# Altium schematic sheet Charge_Conn.SchDoc: Charger Input
size A4; DrawnBy: Samyar Sadat Akhavi; Revision: 1.0; SheetNumber: 4; SheetTotal: 14
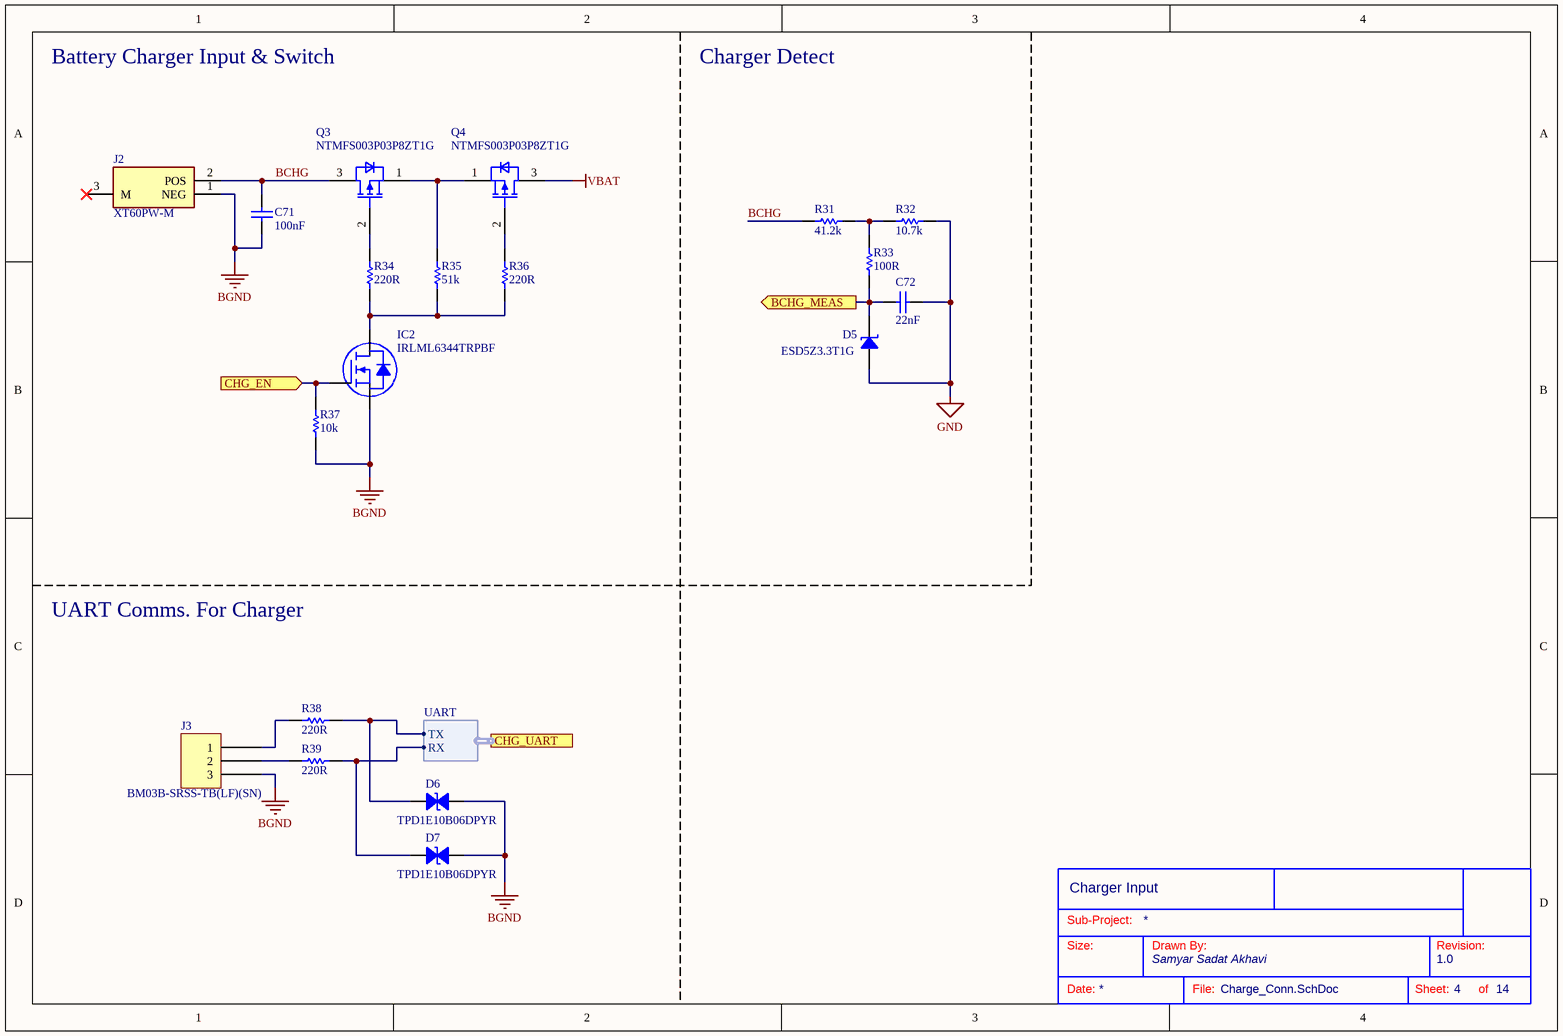
[diagram p0: Charge_Conn.SchDoc]

## Parts
?  (no value)  (graphical)
C71  100nF  [CAP_SMD_603]
C72  22nF  [CAP_SMD_603]
D5  ESD5Z3.3T1G  [SOD523F]
D6  TPD1E10B06DPYR  [0402]
D7  TPD1E10B06DPYR  [0402]
IC2  IRLML6344TRPBF  [INFINEON SOT-23-3]
J2  XT60PW-M  [XT60PWM]
J3  BM03B-SRSS-TB(LF)(SN)  [JST BM03B-SRSS-TB]
Q3  NTMFS003P03P8ZT1G  [NVMFS4C05NWFET1G]
Q4  NTMFS003P03P8ZT1G  [NVMFS4C05NWFET1G]
R31  41.2k  [RES_0603]
R32  10.7k  [RES_0603]
R33  100R  [RES_0603]
R34  220R  [RES_0603]
R35  51k  [RES_0603]
R36  220R  [RES_0603]
R37  10k  [RES_0603]
R38  220R  [RES_0603]
R39  220R  [RES_0603]

## Ports
BCHG_MEAS (out, see Power_Board[2B], Microcontroller[3C]), CHG_EN (in, see Power_Board[2B], Microcontroller[3A]), CHG_UART (harness UART, see Power_Board[2B], Microcontroller[4B])

## Harnesses
UART: TX, RX

## Nets
BGND: C71.1 D6.2 D7.2 IC2.2(S) J2.1(NEG) J3.3 R37.1
GND: C72.1 D5.1 R32.2
VBAT: Q4.3(D)
BCHG: C71.2 J2.2(POS) Q3.3(D) R31.1
BCHG_MEAS: C72.2 D5.2 R33.2 ; port BCHG_MEAS
CHG_EN: IC2.1(G) R37.2 ; port CHG_EN
NetD6_1: D6.1 R38.2 ; port CHG_UART.TX
NetD7_1: D7.1 R39.2 ; port CHG_UART.RX
NetIC2_3: IC2.3(D) R34.2 R35.2 R36.2
NetJ3_1: J3.1 R38.1
NetJ3_2: J3.2 R39.1
NetQ3_1: Q3.1(S) Q4.1(S) R35.1
NetQ3_2: Q3.2(G) R34.1
NetQ4_2: Q4.2(G) R36.1
NetR31_2: R31.2 R32.1 R33.1

Not connected (* = marked no-connect by the designer): J2 3(M)*

## Notes on the sheet
- Battery Charger Input & Switch
- Charger Detect
- UART Comms. For Charger
- Sub-Project:
- Size:
- Drawn By:
- Revision:
- Date:
- File:
- Sheet:
- of

## Library data of the parts
? = Standard Title Block
C71 = Non-polar Capacitor: Generic Ceramic Capacitor; Voltage: 25V; Value: 100nF
C72 = Non-polar Capacitor: Generic Ceramic Capacitor; Voltage: 6.3V; Value: 22nF
D5 = ESD5Z3.3T1G: TVS DIODE 3.3V 14.1V SOD523; Manufacturer: ON Semiconductor; Capacitance @ Frequency: 105pF @ 1MHz; Current - Peak Pulse (10/1000µs): 11.2A (8/20µs); Power Line Protection: No; Power - Peak Pulse: 158W; Type: Zener; Unidirectional Channels: 1; Voltage - Breakdown (Min): 5V; Voltage - Reverse Standoff (Typ): 3.3V (Max); Part Number: ESD5Z3.3T1G; Applications: General Purpose; ComponentLink1Description: Datasheet; ComponentLink1URL: https://www.onsemi.com/pub/Collateral/ESD5Z2.5T1-D.PDF; ComponentLink2Description: DigiKey Link; ComponentLink2URL: http://digikey.com/product-detail/en/on-semiconductor/ESD5Z3.3T1G/ESD5Z3.3T1GOSCT-ND/1967044; LastUpdated: 6/3/2024 8:22:18 PM; Lifecycle Status: Active; Minimum Order: 1; Mounting Type: Surface Mount; Operating Temperature: -55°C ~ 150°C (TJ); Package / Case: SC-79, SOD-523; Packaging: TapeAndReel; PartId: 9754; Part Status: Active; Price: 0.04; Series: -; Supplier 1: DigiKey; Supplier Part Number 1: ESD5Z3.3T1GOSCT-ND; Supplier Device Package: SOD-523; Voltage - Clamping (Max) @ Ipp: 14.1V
D6 D7 = TPD1E10B06DPYR: TVS DIODE 5.5VWM 14VC 2X1SON; Manufacturer: Texas Instruments; Bidirectional Channels: 1; Current - Peak Pulse (10/1000µs): 5A (8/20µs); Power Line Protection: No; Power - Peak Pulse: 90W; Type: Zener; Voltage - Breakdown (Min): 6V; Voltage - Clamping (Max) @ Ipp: 14V; Voltage - Reverse Standoff (Typ): 5.5V (Max); Part Number: TPD1E10B06DPYR; Applications: General Purpose; ComponentLink1Description: Datasheet; ComponentLink1URL: http://www.ti.com/general/docs/suppproductinfo.tsp?distId=10&gotoUrl=http%3A%2F%2Fwww.ti.com%2Flit%2Fgpn%2Ftpd1e10b06; ComponentLink2Description: DigiKey Link; ComponentLink2URL: https://www.digikey.com/en/products/detail/texas-instruments/TPD1E10B06DPYR/3197744; Device Package: 0402 (1005 Metric); LastUpdated: 6/3/2024 8:23:00 PM; Lifecycle Status: Active; Minimum Order: 1; Mounting Type: Surface Mount; Operating Temperature: -40°C ~ 125°C (TA); Package / Case: 0402 (1005 Metric); Packaging: TapeAndReel; PartId: 10446; Part Status: Active; Price: 0.06; Series: -; Supplier 1: DigiKey; Supplier Part Number 1: 296-30406-1-ND; Supplier Device Package: 2-X1SON (1x.60)
IC2 = IRLML6344TRPBF: MOSFET N-CH 30V 5A MICRO3/SOT23; Manufacturer: Infineon Technologies; Current - Continuous Drain (Id) @ 25°C: 5A (Ta); Drive Voltage (Max Rds On,  Min Rds On): 2.5V, 4.5V; FET Type: N-Channel; Gate Charge (Qg) (Max) @ Vgs: 6.8 nC @ 4.5 V; Input Capacitance (Ciss) (Max) @ Vds: 650 pF @ 25 V; Power Dissipation (Max): 1.3W (Ta); Rds On (Max) @ Id, Vgs: 29mOhm @ 5A, 4.5V; Vgs (Max): ±12V; Vgs(th) (Max) @ Id: 1.1V @ 10µA; Part Number: IRLML6344TRPBF; ComponentLink1Description: Datasheet; ComponentLink1URL: https://www.infineon.com/dgdl/irlml6344pbf.pdf?fileId=5546d462533600a4015356689c44262c; ComponentLink2Description: DigiKey Link; ComponentLink2URL: https://www.digikey.com/en/products/detail/infineon-technologies/IRLML6344TRPBF/2538152; Drain to Source Voltage (Vdss): 30 V; LastUpdated: 6/3/2024 8:15:23 PM; Lifecycle Status: Active; Minimum Order: 1; Mounting Type: Surface Mount; Operating Temperature: -55°C ~ 150°C (TJ); Package / Case: TO-236-3, SC-59, SOT-23-3; Packaging: TapeAndReel; Part Status: Active; Price: 0.10; Series: HEXFET®; Supplier 1: DigiKey; Supplier Part Number 1: IRLML6344TRPBFCT-ND; Supplier Device Package: Micro3™/SOT-23; Technology: MOSFET (Metal Oxide)
J2 = XT60PW-M: Connector; Manufacturer_Name: Amass; Datasheet Link: https://www.tme.eu/Document/b13629717d44ae038681dba08d18c0b6/XT60PW-M.pdf; Height: 8.4mm; Manufacturer_Part_Number: XT60PW-M
J3 = BM03B-SRSS-TB(LF)(SN): CONN HEADER SMD 3POS 1MM; Manufacturer: JST Sales America Inc.; Current Rating (Amps): 0.7A; Material Flammability Rating: UL94 V-0; Number of Positions: 3; Number of Positions Loaded: All; Pitch - Mating: 0.039" (1.00mm); Shrouding: Shrouded - 4 Wall; Style: Board to Cable/Wire; Voltage Rating: 50V; Part Number: BM03B-SRSS-TB(LF)(SN); ComponentLink1Description: Datasheet; ComponentLink1URL: http://www.jst-mfg.com/product/pdf/eng/eSR.pdf; ComponentLink2Description: DigiKey Link; ComponentLink2URL: http://digikey.com/product-detail/en/jst-sales-america-inc/BM03B-SRSS-TB-LF-SN/455-1789-1-ND/926860; Connector Type: Header; Contact Finish - Mating: Tin; Contact Finish - Post: Tin; Contact Material: Copper Alloy; Contact Shape: Square; Contact Type: Male Pin; Fastening Type: Push-Pull; Features: Solder Retention; Insulation Color: Natural; Insulation Height: 0.167" (4.25mm); Insulation Material: Polyamide (PA), Nylon; LastUpdated: 1/12/2020 10:12:14 PM; Lifecycle Status: Active; Minimum Order: 1; Mounting Type: Surface Mount; Number of Rows: 1; Operating Temperature: -25°C ~ 85°C; Packaging: TapeAndReel; PartId: 14; Part Status: Active; Price: 0.24; Series: SR; Supplier 1: DigiKey; Supplier Part Number 1: 455-1789-1-ND; Termination: Solder
Q3 Q4 = NTMFS003P03P8ZT1G: MOSFET (P-Channel); Manufacturer_Name: onsemi; Datasheet Link: https://www.onsemi.com/pub/Collateral/NTMFS003P03P8Z-D.PDF; Height: 1.1mm; Manufacturer_Part_Number: NTMFS003P03P8ZT1G
R31-R39 = Resistor: Power: 1/8W
  R31: Value: 41.2k
  R32: Value: 10.7k
  R33: Value: 100R
  R34 R36 R38 R39: Value: 220R
  R35: Value: 51k
  R37: Value: 10k